# Altium schematic sheet expansion_port.SchDoc: Expansion port
size A4; SheetNumber: 18; SheetTotal: 20; TitleBig: Expansion port & jack connector; Desc_line1: Expansion port for added functionality, such as an ultrasould resonance analysis for wood boards.; Desc_line2: Also, this sheet includes a description of the jack connector properties.
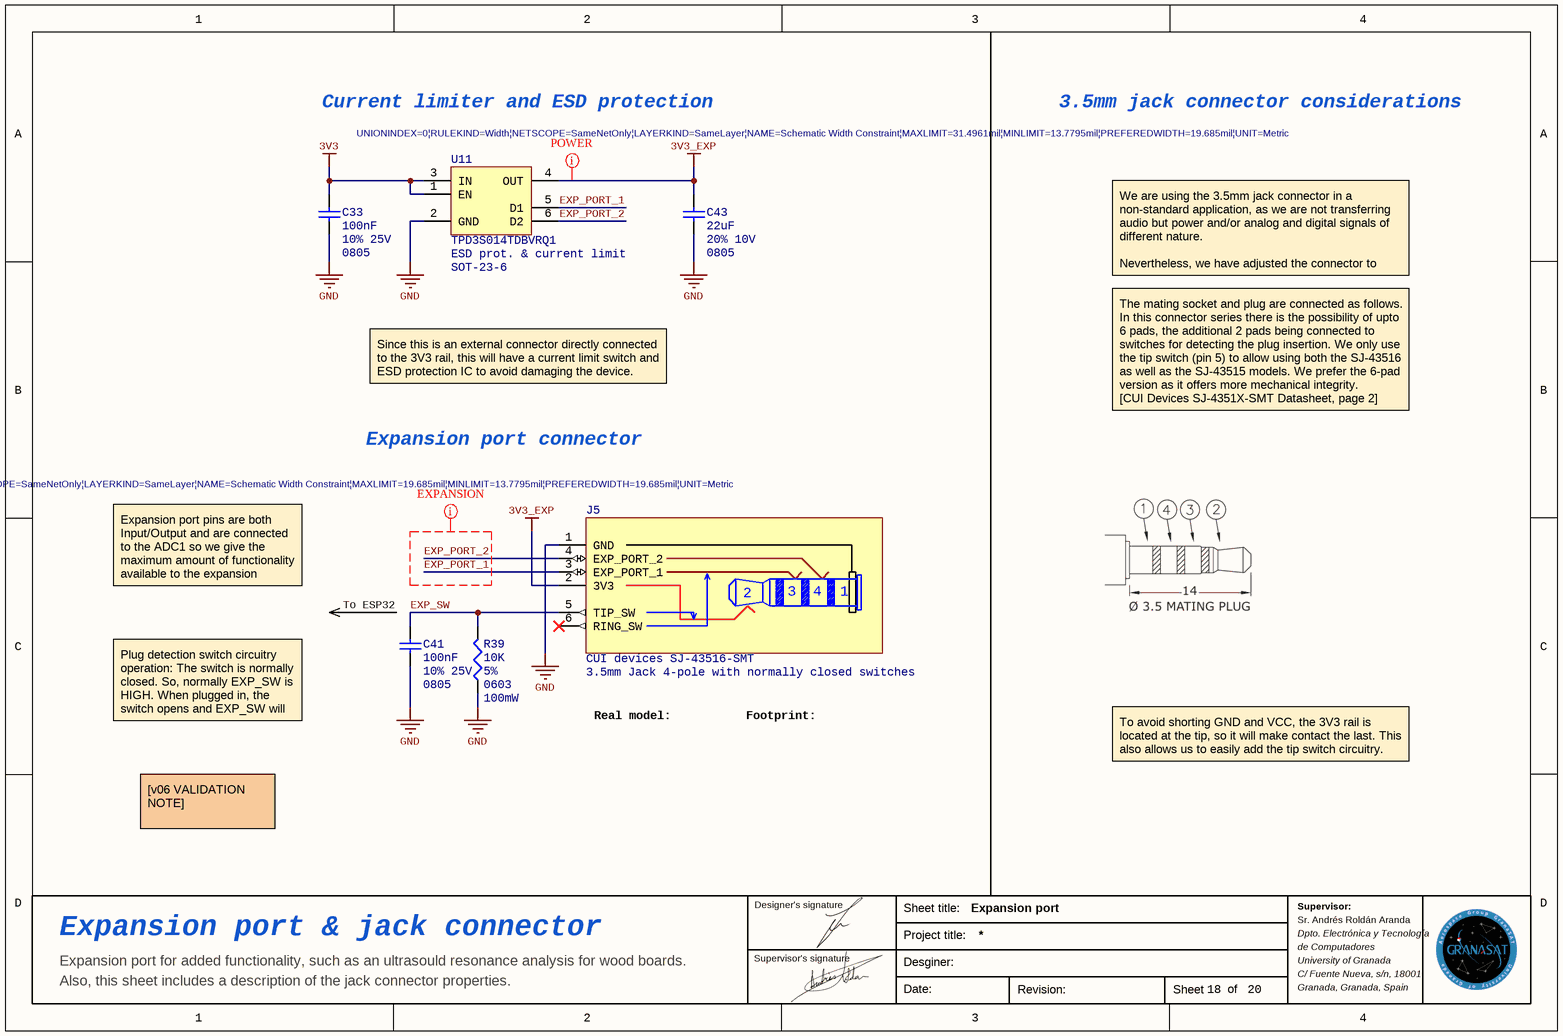
[diagram p0: expansion_port.SchDoc]

## Parts
C33  value 100nF  Tolerance: 10% 25V  PackageDescription: 0805  [CAP 0805_2012]  (hidden comment: Cap_cer_0805)
C41  value 100nF  Tolerance: 10% 25V  PackageDescription: 0805  [CAP 0805_2012]  (hidden comment: Cap_cer_0805)
C43  value 22uF  Tolerance: 20% 10V  PackageDescription: 0805  [CAP 0805_2012]  (hidden comment: Cap_cer_0805)
J5  Part: CUI devices SJ-43516-SMT  [JACK_6_CONN_CUI_DEVICES_SJ-43516-SMT]  (hidden comment: CON EXPANSION_PORT)
R39  value 10K  Tolerance: 5%  PackageDescription: 0603  PowerDisipated: 100mW  [RES 0603_1608]  (hidden comment: Res_0603_10K_5%_100mW_1)
U11  Part: TPD3S014TDBVRQ1  PackageDescription: SOT-23-6  Desc: ESD prot. & current limit  [TSOT-23-6 TPD3S014TDBVRQ1]  (hidden comment: IC TPD3S014 Current switch)

## Nets
3V3: C33.2 U11.1(EN) U11.3(IN)
3V3_EXP: C43.2 J5.2(3V3) U11.4(OUT)
GND: C33.1 C41.1 C43.1 J5.1(GND) R39.1 U11.2(GND)
EXP_PORT_1: J5.3(EXP_PORT_1) U11.5(D1)
EXP_PORT_2: J5.4(EXP_PORT_2) U11.6(D2)
EXP_SW: C41.2 J5.5(TIP_SW) R39.2

Not connected (* = marked no-connect by the designer): J5 6(RING_SW)*

## Layout directives
net class EXPANSION; rule Width Constraint [Pref Width = 0.5mm    Min Width = 0.35mm    Max Width = 0.5mm]: EXP_PORT_1, EXP_PORT_2
net class POWER; rule Width Constraint [Pref Width = 0.5mm    Min Width = 0.35mm    Max Width = 0.8mm]: 3V3_EXP

## Notes on the sheet
- Current limiter and ESD protection
- 3.5mm jack connector considerations
- We are using the 3.5mm jack connector in a non-standard application, as we are not transferring audio but power and/or analog and digital signals of different nature.
  Nevertheless, we have adjusted the connector to somewhat fit the OMPT convention (GND in sleeve, signals in rings).
- Since this is an external connector directly connected to the 3V3 rail, this will have a current limit switch and ESD protection IC to avoid damaging the device.
- Expansion port connector
- The mating socket and plug are connected as follows.
  In this connector series there is the possibility of upto 6 pads, the additional 2 pads being connected to switches for detecting the plug insertion. We only use the tip switch (pin 5) to allow using both the SJ-43516 as well as the SJ-43515 models. We prefer the 6-pad version as it offers more mechanical integrity.
  [CUI Devices SJ-4351X-SMT Datasheet, page 2]
- Expansion port pins are both Input/Output and are connected to the ADC1 so we give the maximum amount of functionality available to the expansion module.
- (near C41) To ESP32
- Plug detection switch circuitry operation: The switch is normally closed. So, normally EXP_SW is HIGH. When plugged in, the switch opens and EXP_SW will be LOW
- Real model:
- Footprint:
- To avoid shorting GND and VCC, the 3V3 rail is located at the tip, so it will make contact the last. This also allows us to easily add the tip switch circuitry.
- [v06 VALIDATION NOTE]
  UNTESTED
- Designer's signature
- Sheet title:
- Sr. Andrés Roldán Aranda
- Supervisor:
- Supervisor's signature
- Project title:
- Desginer:
- Dpto. Electrónica y Tecnología
- de Computadores
- University of Granada
- C/ Fuente Nueva, s/n, 18001
- Granada, Granada, Spain
- Date:
- Revision:
- Sheet
- of

## Library data of the parts
C33 C41 = Cap_cer_0805_100nF_10%: Ceramic cap size 0805
C43 = Cap_cer_0805_22uF_20%: Ceramic cap size 0805 CC0805MKX5R6BB226 Yageo MLCC 22uF 10V 20% X5R
J5 = CON EXPANSION_PORT: 3.5mm Jack 4-pole with normally closed switches; Desc: 3.5mm Jack 4-pole with normally closed switches
R39 = Res_0603_10K_5%_100mW_1: Res size 0603 SMD mounting, low power
U11 = IC TPD3S014 Current switch: TPD3S014TDBVRQ1 ESD prot. & current limit